# EAGLE schematic Schematic (EAGLE 8.2.2)
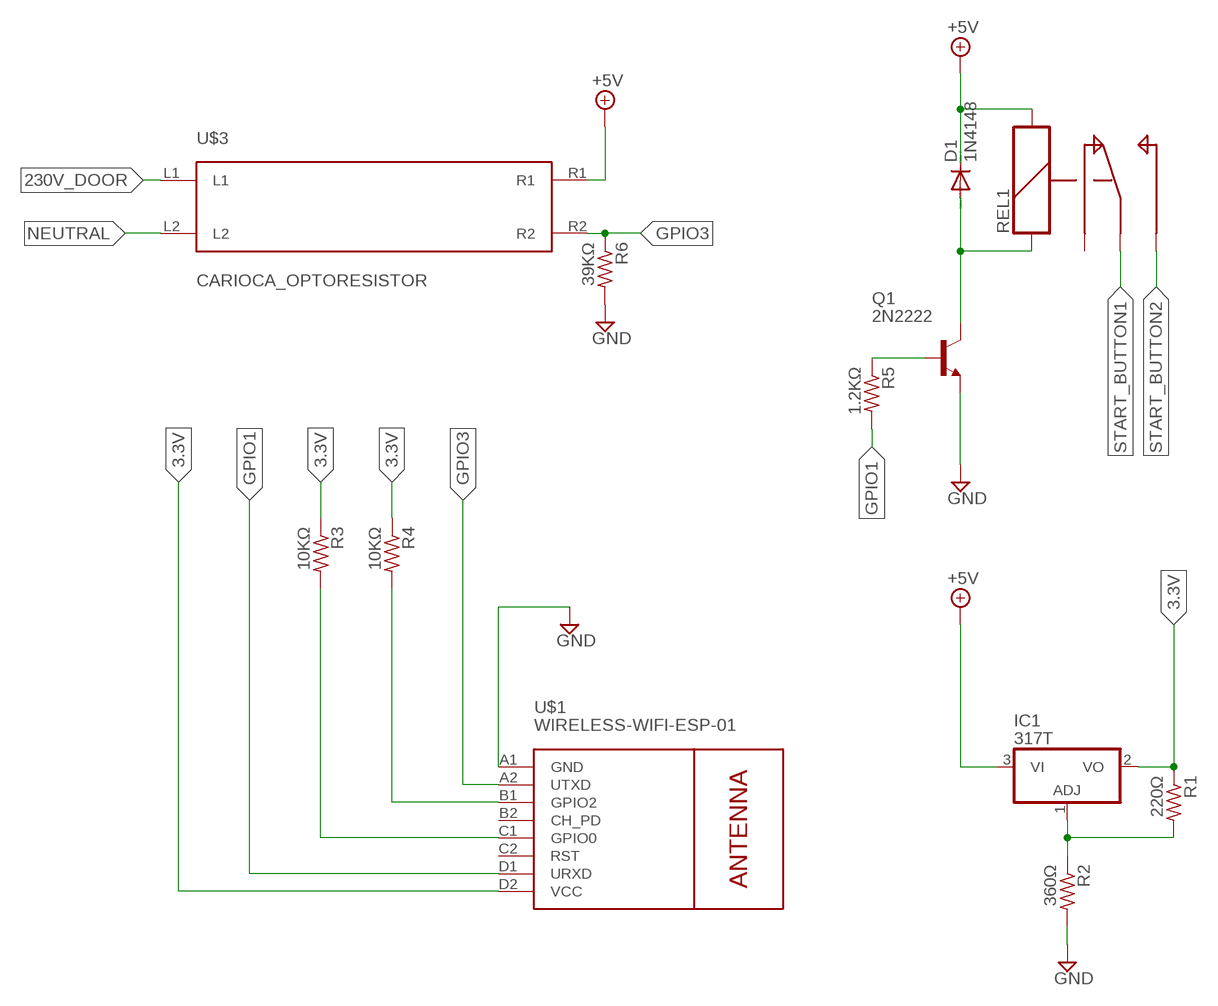
[diagram p0: schematic, sheet 1]

## Parts
D1  1N4148  1N4148DO35-10  [DO35-10]
IC1  317T  [TO220H]
Q1  2N2222  [TO18]
R1  220Ω  R-US_0204/5  [0204/5]
R2  360Ω  R-US_0204/5  [0204/5]
R3  10KΩ  R-US_0204/5  [0204/5]
R4  10KΩ  R-US_0204/5  [0204/5]
R5  1.2KΩ  R-US_0204/5  [0204/5]
R6  39KΩ  R-US_0204/5  [0204/5]
REL1  REL-5PIN  [REL-5PIN]
U$1  WIRELESS-WIFI-ESP-01  [WIRELESS-WIFI-ESP-01]
U$3  CARIOCA_OPTORESISTOR  CARIOCA_PHOTORESISTOR  [CARIOCA_OPTORESISTOR]

## Nets
3.3V: IC1.2(VO) R1.1 R3.1 R4.1 U$1.D2(VCC)
230V_DOOR: U$3.L1
+5V: D1.C IC1.3(VI) REL1.S2 U$3.R1
GND: Q1.1(E) R2.2 R6.2 U$1.A1(GND)
GPIO1: R5.2 U$1.D1(URXD)
GPIO3: R6.1 U$1.A2(UTXD) U$3.R2
N$1: R4.2 U$1.B1(GPIO2)
N$2: IC1.1(ADJ) R1.2 R2.1
N$3: R3.2 U$1.C1(GPIO0)
N$4: Q1.2(B) R5.1
N$5: D1.A Q1.3(C) REL1.S1
NEUTRAL: U$3.L2
START_BUTTON1: REL1.C
START_BUTTON2: REL1.O
Unconnected: REL1.S U$1.B2(CH_PD) U$1.C2(RST)

## Library data of the parts
D1 = diode:1N4148: DIODE high speed (Philips)
IC1 = linear:*317: Positive VOLTAGE REGULATOR
Q1 = transistor-npn:2N2222*: NPN Transistor
R1-R6 = resistor:R-US_: RESISTOR, American symbol
REL1 = special:REL-5PIN: RELAY
U$1 = diy-modules:WIRELESS-WIFI-ESP-01: Wireless Wi-Fi ESP-01 Module based on ESP8266 chip Click here to find device on ebay.com <http://www.ebay.com/sch/esp8266+esp+01+transceiver>
U$3 = Libraries:CARIOCA_PHOTORESISTOR